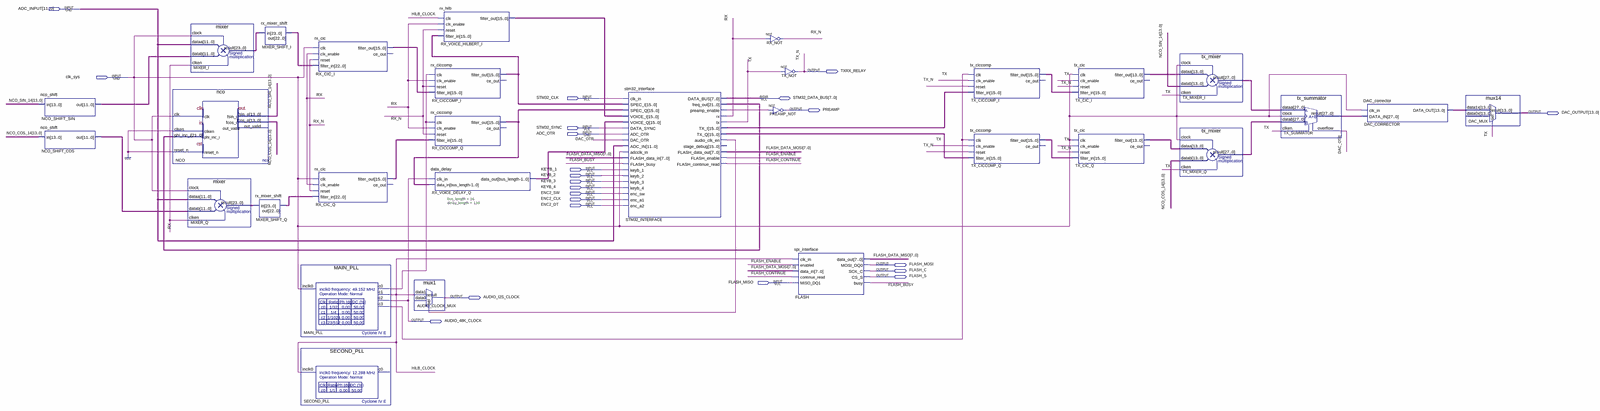
[diagram p0: schematic sheet, whole]
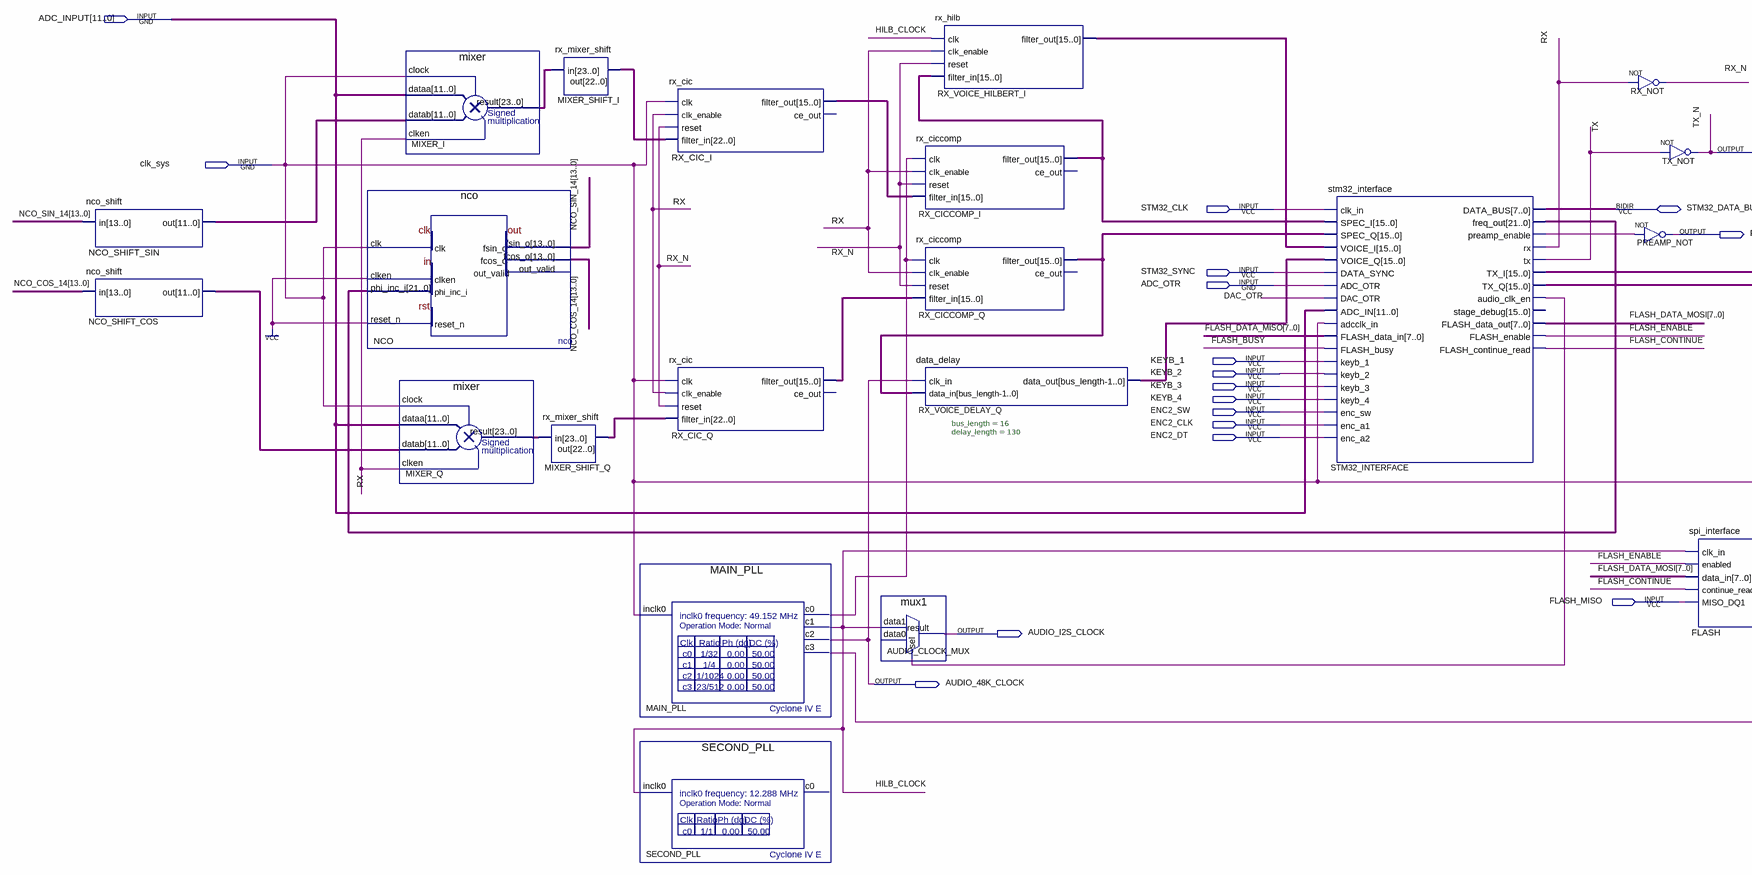
[diagram p1: schematic sheet, left part]
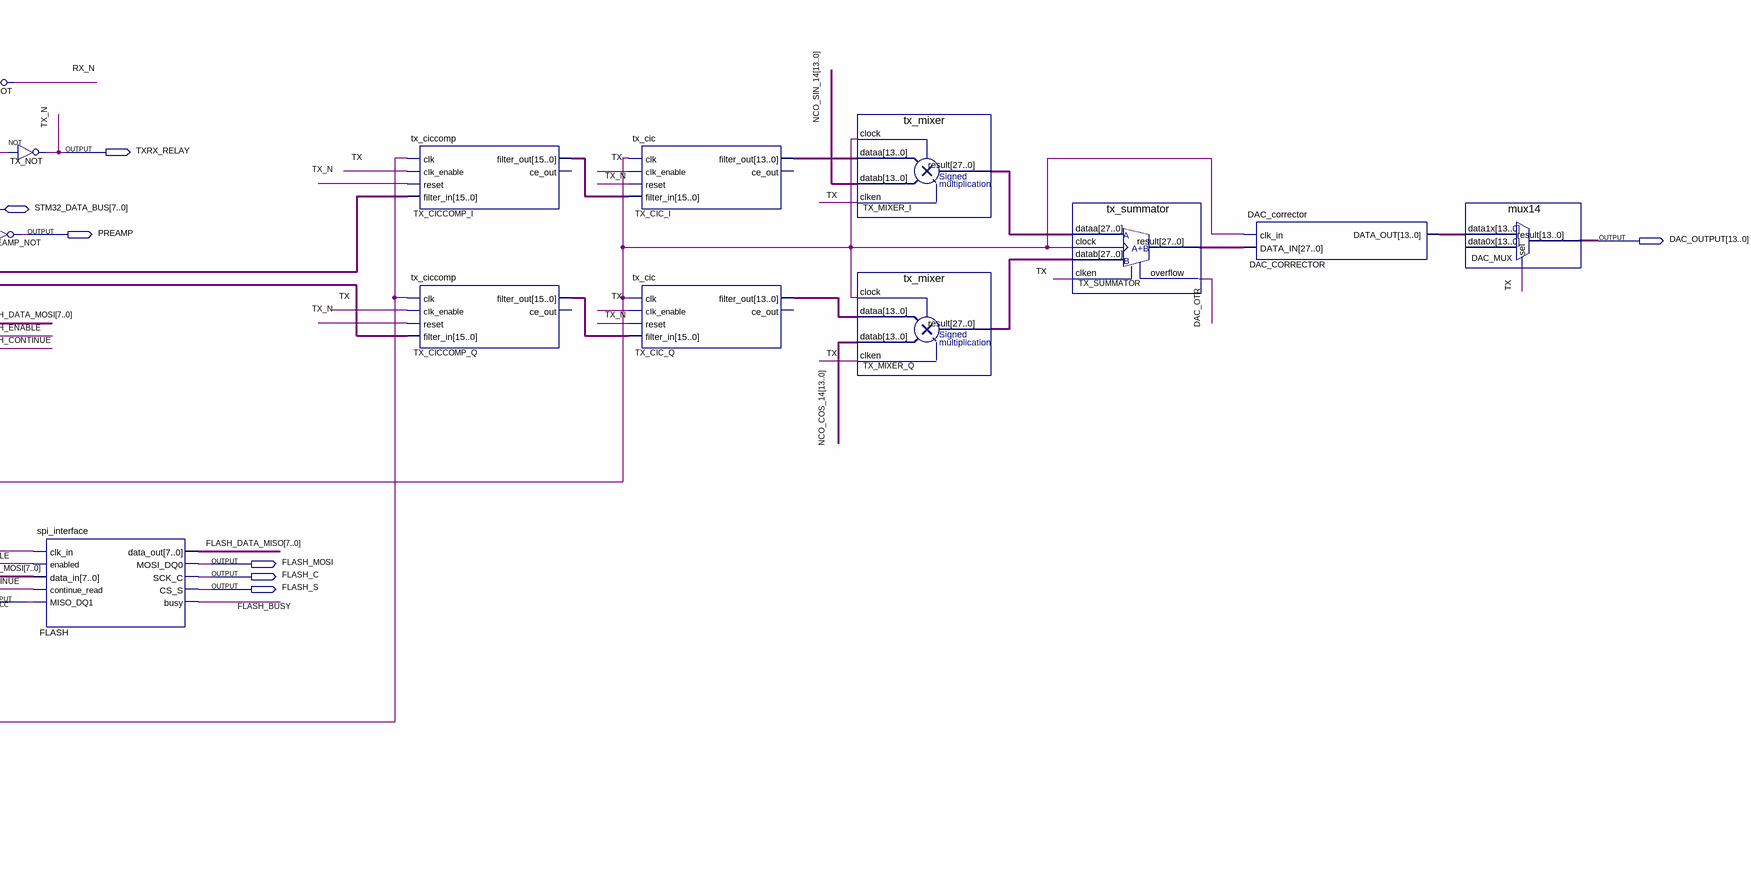
[diagram p2: schematic sheet, right part]
// Quartus schematic UA3REO.bdf as structural Verilog: 30 symbols, 22 pins
module UA3REO (
  input  [11:0] ADC_INPUT,
  input  clk_sys,
  input  STM32_CLK,
  input  STM32_SYNC,
  input  ADC_OTR,
  input  KEYB_1,
  input  KEYB_2,
  input  KEYB_3,
  input  KEYB_4,
  input  ENC2_SW,
  input  ENC2_CLK,
  input  ENC2_DT,
  input  FLASH_MISO,
  inout  [7:0] STM32_DATA_BUS,
  output TXRX_RELAY,
  output PREAMP,
  output [13:0] DAC_OUTPUT,
  output FLASH_MOSI,
  output FLASH_C,
  output FLASH_S,
  output AUDIO_I2S_CLOCK,
  output AUDIO_48K_CLOCK
);

  wire DAC_OTR, FLASH_BUSY, FLASH_CONTINUE, FLASH_ENABLE, HILB_CLOCK, MAIN_PLL_c0, MAIN_PLL_c3, RX, RX_N,
       STM32_INTERFACE_audio_clk_en, STM32_INTERFACE_preamp_enable, TX;
  wire [7:0] FLASH_DATA_MISO, FLASH_DATA_MOSI;
  wire [11:0] NCO_SHIFT_COS_out, NCO_SHIFT_SIN_out;
  wire [13:0] DAC_CORRECTOR_data_out, NCO_COS_14, NCO_SIN_14, TX_CIC_I_filter_out, TX_CIC_Q_filter_out;
  wire [15:0] RX_CIC_I_filter_out, RX_CIC_Q_filter_out, RX_CICCOMP_I_filter_out, RX_CICCOMP_Q_filter_out,
       RX_VOICE_DELAY_Q_data_out, RX_VOICE_HILBERT_I_filter_out, STM32_INTERFACE_tx_i, STM32_INTERFACE_tx_q,
       TX_CICCOMP_I_filter_out, TX_CICCOMP_Q_filter_out;
  wire [21:0] STM32_INTERFACE_freq_out;
  wire [22:0] MIXER_SHIFT_I_out, MIXER_SHIFT_Q_out;
  wire [23:0] MIXER_I_result, MIXER_Q_result;
  wire [27:0] TX_MIXER_I_result, TX_MIXER_Q_result, TX_SUMMATOR_result;

  nco_shift NCO_SHIFT_SIN (.in(NCO_SIN_14), .out(NCO_SHIFT_SIN_out));
  nco_shift NCO_SHIFT_COS (.in(NCO_COS_14), .out(NCO_SHIFT_COS_out));
  nco NCO (
    .clk(clk_sys), .clken(1'b1), .phi_inc_i(STM32_INTERFACE_freq_out), .reset_n(1'b1), .fsin_o(NCO_SIN_14),
    .fcos_o(NCO_COS_14));  // open: out_valid
  mixer MIXER_I (.clock(clk_sys), .dataa(ADC_INPUT), .datab(NCO_SHIFT_SIN_out), .clken(RX), .result(MIXER_I_result));
  mixer MIXER_Q (.clock(clk_sys), .dataa(ADC_INPUT), .datab(NCO_SHIFT_COS_out), .clken(RX), .result(MIXER_Q_result));
  rx_mixer_shift MIXER_SHIFT_Q (.in(MIXER_Q_result), .out(MIXER_SHIFT_Q_out));
  rx_mixer_shift MIXER_SHIFT_I (.in(MIXER_I_result), .out(MIXER_SHIFT_I_out));
  MAIN_PLL MAIN_PLL (.inclk0(clk_sys), .c0(MAIN_PLL_c0), .c1(HILB_CLOCK), .c2(AUDIO_48K_CLOCK), .c3(MAIN_PLL_c3));
  SECOND_PLL SECOND_PLL (.inclk0(HILB_CLOCK));  // open: c0
  rx_cic RX_CIC_I (
    .clk(clk_sys), .clk_enable(RX), .reset(RX_N), .filter_in(MIXER_SHIFT_I_out),
    .filter_out(RX_CIC_I_filter_out));  // open: ce_out
  rx_cic RX_CIC_Q (
    .clk(clk_sys), .clk_enable(RX), .reset(RX_N), .filter_in(MIXER_SHIFT_Q_out),
    .filter_out(RX_CIC_Q_filter_out));  // open: ce_out
  mux1 AUDIO_CLOCK_MUX (
    .data1(HILB_CLOCK), .sel(STM32_INTERFACE_audio_clk_en), .result(AUDIO_I2S_CLOCK));  // open: data0
  rx_hilb RX_VOICE_HILBERT_I (
    .clk(HILB_CLOCK), .clk_enable(RX), .reset(RX_N), .filter_in(RX_CICCOMP_I_filter_out),
    .filter_out(RX_VOICE_HILBERT_I_filter_out));
  rx_ciccomp RX_CICCOMP_I (
    .clk(MAIN_PLL_c0), .clk_enable(RX), .reset(RX_N), .filter_in(RX_CIC_I_filter_out),
    .filter_out(RX_CICCOMP_I_filter_out));  // open: ce_out
  rx_ciccomp RX_CICCOMP_Q (
    .clk(MAIN_PLL_c0), .clk_enable(RX), .reset(RX_N), .filter_in(RX_CIC_Q_filter_out),
    .filter_out(RX_CICCOMP_Q_filter_out));  // open: ce_out
  data_delay #(.bus_length(16), .delay_length(130)) RX_VOICE_DELAY_Q (
    .clk_in(AUDIO_48K_CLOCK), .data_in(RX_CICCOMP_Q_filter_out), .data_out(RX_VOICE_DELAY_Q_data_out));
  stm32_interface STM32_INTERFACE (
    .clk_in(STM32_CLK), .SPEC_I(RX_CICCOMP_I_filter_out), .SPEC_Q(RX_CICCOMP_Q_filter_out),
    .VOICE_I(RX_VOICE_HILBERT_I_filter_out), .VOICE_Q(RX_VOICE_DELAY_Q_data_out), .DATA_SYNC(STM32_SYNC),
    .ADC_OTR(ADC_OTR), .DAC_OTR(DAC_OTR), .ADC_IN(ADC_INPUT), .adcclk_in(clk_sys),
    .FLASH_data_in(FLASH_DATA_MISO), .FLASH_busy(FLASH_BUSY), .keyb_1(KEYB_1), .keyb_2(KEYB_2),
    .keyb_3(KEYB_3), .keyb_4(KEYB_4), .enc_sw(ENC2_SW), .enc_a1(ENC2_CLK), .enc_a2(ENC2_DT),
    .freq_out(STM32_INTERFACE_freq_out), .preamp_enable(STM32_INTERFACE_preamp_enable), .rx(RX), .tx(TX),
    .TX_I(STM32_INTERFACE_tx_i), .TX_Q(STM32_INTERFACE_tx_q), .audio_clk_en(STM32_INTERFACE_audio_clk_en),
    .FLASH_data_out(FLASH_DATA_MOSI), .FLASH_enable(FLASH_ENABLE), .FLASH_continue_read(FLASH_CONTINUE),
    .DATA_BUS(STM32_DATA_BUS));  // open: stage_debug
  not RX_NOT (RX_N, RX);
  not PREAMP_NOT (PREAMP, STM32_INTERFACE_preamp_enable);
  not TX_NOT (TXRX_RELAY, TX);
  spi_interface FLASH (
    .clk_in(HILB_CLOCK), .enabled(FLASH_ENABLE), .data_in(FLASH_DATA_MOSI), .continue_read(FLASH_CONTINUE),
    .MISO_DQ1(FLASH_MISO), .data_out(FLASH_DATA_MISO), .MOSI_DQ0(FLASH_MOSI), .SCK_C(FLASH_C),
    .CS_S(FLASH_S), .busy(FLASH_BUSY));
  tx_ciccomp TX_CICCOMP_I (
    .clk(MAIN_PLL_c3), .clk_enable(TX), .reset(TXRX_RELAY), .filter_in(STM32_INTERFACE_tx_i),
    .filter_out(TX_CICCOMP_I_filter_out));  // open: ce_out
  tx_ciccomp TX_CICCOMP_Q (
    .clk(MAIN_PLL_c3), .clk_enable(TX), .reset(TXRX_RELAY), .filter_in(STM32_INTERFACE_tx_q),
    .filter_out(TX_CICCOMP_Q_filter_out));  // open: ce_out
  tx_cic TX_CIC_I (
    .clk(clk_sys), .clk_enable(TX), .reset(TXRX_RELAY), .filter_in(TX_CICCOMP_I_filter_out),
    .filter_out(TX_CIC_I_filter_out));  // open: ce_out
  tx_cic TX_CIC_Q (
    .clk(clk_sys), .clk_enable(TX), .reset(TXRX_RELAY), .filter_in(TX_CICCOMP_Q_filter_out),
    .filter_out(TX_CIC_Q_filter_out));  // open: ce_out
  tx_mixer TX_MIXER_I (
    .clock(clk_sys), .dataa(TX_CIC_I_filter_out), .datab(NCO_SIN_14), .clken(TX), .result(TX_MIXER_I_result));
  tx_mixer TX_MIXER_Q (
    .clock(clk_sys), .dataa(TX_CIC_Q_filter_out), .datab(NCO_COS_14), .clken(TX), .result(TX_MIXER_Q_result));
  tx_summator TX_SUMMATOR (
    .dataa(TX_MIXER_I_result), .datab(TX_MIXER_Q_result), .clken(TX), .clock(clk_sys),
    .result(TX_SUMMATOR_result), .overflow(DAC_OTR));
  DAC_corrector DAC_CORRECTOR (.clk_in(clk_sys), .DATA_IN(TX_SUMMATOR_result), .DATA_OUT(DAC_CORRECTOR_data_out));
  mux14 DAC_MUX (.data1x(DAC_CORRECTOR_data_out), .sel(TX), .result(DAC_OUTPUT));  // open: data0x

  // Other names for the same wires on the sheet: TX_N = TXRX_RELAY
endmodule
